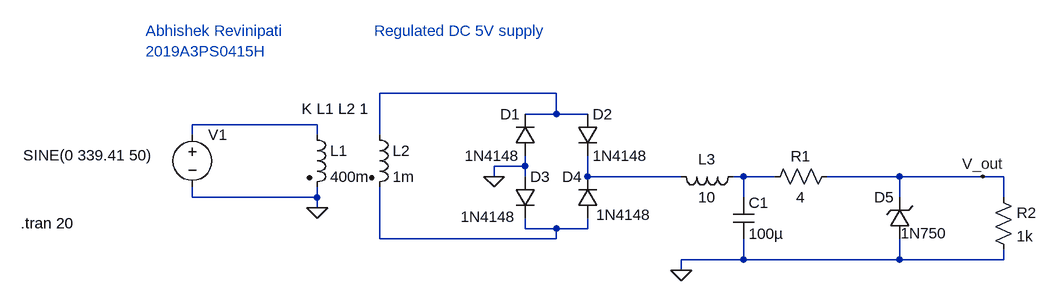
[diagram p0: schematic 2019A3PS0415H_reg_voltage.asc]
2019A3PS0415H_reg_voltage.asc, the LTspice schematic file:
Version 4
SHEET 1 1272 680
WIRE 528 64 256 64
WIRE 528 96 528 64
WIRE 528 96 480 96
WIRE 576 96 528 96
WIRE 160 112 -32 112
WIRE -32 128 -32 112
WIRE 160 128 160 112
WIRE 256 128 256 64
WIRE 480 176 480 160
WIRE 480 176 432 176
WIRE 432 192 432 176
WIRE 480 192 480 176
WIRE 576 192 576 160
WIRE 720 192 576 192
WIRE 816 192 800 192
WIRE 864 192 816 192
WIRE 1056 192 944 192
WIRE 1184 192 1056 192
WIRE 1216 192 1184 192
WIRE -32 224 -32 208
WIRE 160 224 160 208
WIRE 160 224 -32 224
WIRE 816 224 816 192
WIRE 1056 224 1056 192
WIRE 1216 224 1216 192
WIRE 160 240 160 224
WIRE 480 272 480 256
WIRE 528 272 480 272
WIRE 576 272 576 256
WIRE 576 272 528 272
WIRE 256 288 256 208
WIRE 528 288 528 272
WIRE 528 288 256 288
WIRE 816 320 816 288
WIRE 816 320 720 320
WIRE 1056 320 1056 288
WIRE 1056 320 816 320
WIRE 1216 320 1216 304
WIRE 1216 320 1056 320
WIRE 720 336 720 320
FLAG 160 240 0
FLAG 432 192 0
FLAG 720 336 0
FLAG 1184 192 V_out
SYMBOL voltage -32 112 R0
WINDOW 3 -260 47 Left 2
WINDOW 123 0 0 Left 0
WINDOW 39 0 0 Left 0
SYMATTR Value SINE(0 339.41 50)
SYMATTR InstName V1
SYMBOL ind2 144 112 R0
SYMATTR InstName L1
SYMATTR Value 400m
SYMATTR Type ind
SYMATTR SpiceLine Rser=0.01
SYMBOL ind2 240 112 R0
SYMATTR InstName L2
SYMATTR Value 1m
SYMATTR Type ind
SYMBOL diode 496 160 R180
WINDOW 0 24 64 Left 2
WINDOW 3 24 0 Left 2
SYMATTR InstName D1
SYMATTR Value 1N4148
SYMBOL diode 560 96 R0
SYMATTR InstName D2
SYMATTR Value 1N4148
SYMBOL diode 464 192 R0
WINDOW 3 -83 62 Left 2
SYMATTR Value 1N4148
SYMATTR InstName D3
SYMBOL diode 592 256 R180
WINDOW 0 24 64 Left 2
WINDOW 3 -82 5 Left 2
SYMATTR InstName D4
SYMATTR Value 1N4148
SYMBOL zener 1072 288 R180
WINDOW 0 24 64 Left 2
WINDOW 3 -57 9 Left 2
SYMATTR InstName D5
SYMATTR Value 1N750
SYMATTR Description Diode
SYMATTR Type diode
SYMBOL res 1200 208 R0
SYMATTR InstName R2
SYMATTR Value 1k
SYMBOL ind 816 176 R90
WINDOW 0 5 56 VBottom 2
WINDOW 3 32 56 VTop 2
SYMATTR InstName L3
SYMATTR Value 10
SYMBOL cap 800 224 R0
SYMATTR InstName C1
SYMATTR Value 100µ
SYMBOL res 960 176 R90
WINDOW 0 0 56 VBottom 2
WINDOW 3 32 56 VTop 2
SYMATTR InstName R1
SYMATTR Value 4
TEXT 136 88 Left 2 !K L1 L2 1
TEXT -296 264 Left 2 !.tran 20
TEXT 248 -32 Left 2 ;Regulated DC 5V supply
TEXT -104 -32 Left 2 ;Abhishek Revinipati\n2019A3PS0415H

The netlist it stands for:
* 2019A3PS0415H_reg_voltage.asc
V1 N002 0 SINE(0 339.41 50)
L1 N002 0 400m Rser=0.01
L2 N001 N005 1m
D1 0 N001 1N4148
D2 N001 N003 1N4148
D3 0 N005 1N4148
D4 N005 N003 1N4148
D5 0 V_out 1N750
R2 V_out 0 1k
L3 N004 N003 10
C1 N004 0 100µ
R1 V_out N004 4
.model D D
.lib standard.dio
K L1 L2 1
.tran 20
* Regulated DC 5V supply
* Abhishek Revinipati
* 2019A3PS0415H
.backanno
.end